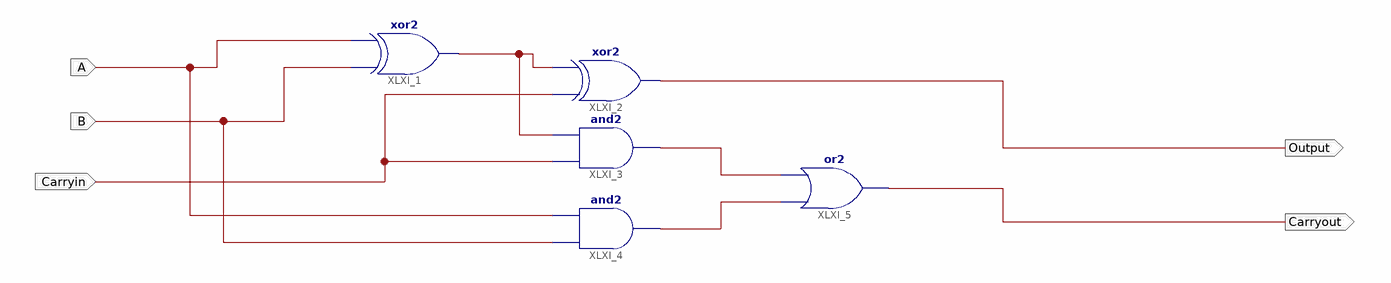
[diagram p0: schematic sheet 1]
// Xilinx ISE schematic proj1FullAdder1to1.sch (spartan6) as structural Verilog: 5 symbols, 5 ports
module proj1FullAdder1to1 (
  input  A,
  input  B,
  input  Carryin,
  output Carryout,
  output Output
);

  wire XLXN_29, XLXN_32, XLXN_33;

  xor XLXI_1 (XLXN_29, B, A);
  xor XLXI_2 (Output, Carryin, XLXN_29);
  and XLXI_3 (XLXN_32, Carryin, XLXN_29);
  and XLXI_4 (XLXN_33, B, A);
  or XLXI_5 (Carryout, XLXN_33, XLXN_32);
endmodule
